# EAGLE design pipower (EAGLE 7.1.0)
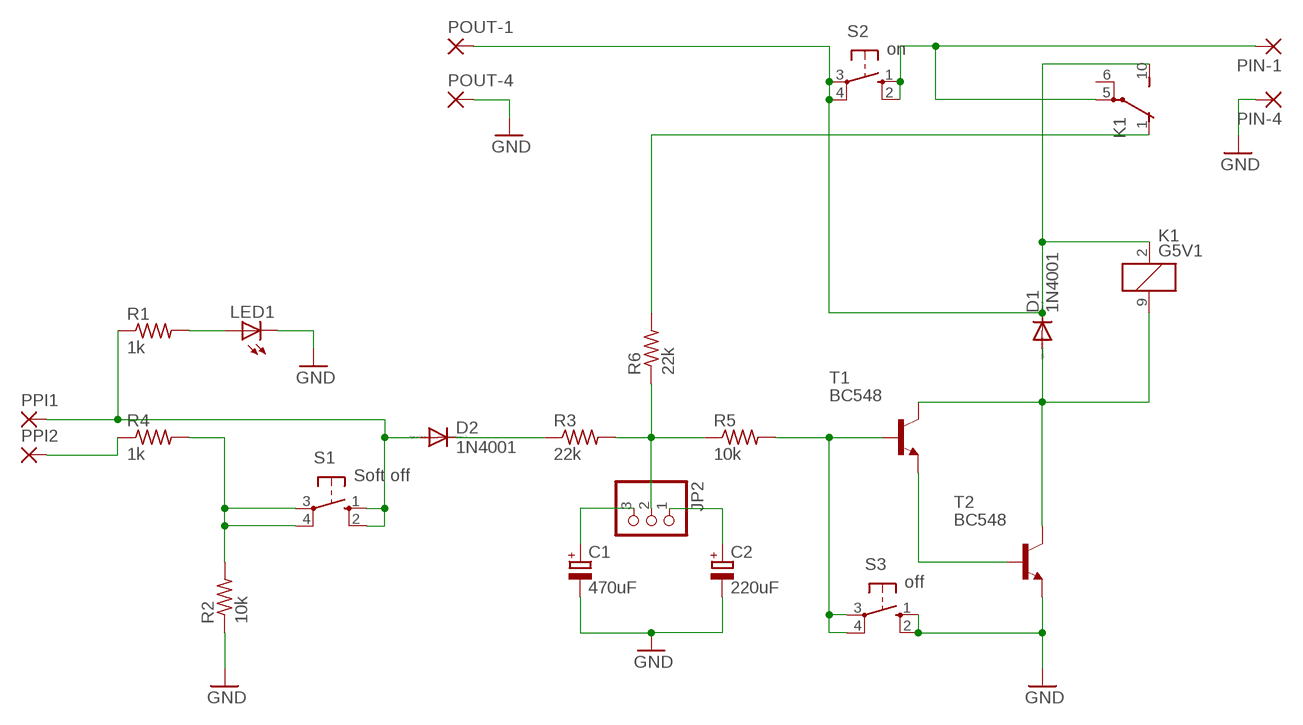
[diagram p0: schematic, sheet 1]

## Parts
C1  470uF  CPOL-EUE2.5-7  [E2,5-7]
C2  220uF  CPOL-EUE2.5-6  [E2,5-6]
D1  1N4001  1N4004  [DO41-10]
D2  1N4001  1N4004  [DO41-10]
JP2  PINHD-1X3  [1X03]
K1  G5V1  [G5V1]
LED1  LED3MM  [LED3MM]
PIN-1  2,54/1,0  [2,54/1,0]
PIN-4  2,54/1,0  [2,54/1,0]
POUT-1  2,54/1,0  [2,54/1,0]
POUT-4  2,54/1,0  [2,54/1,0]
PPI1  2,54/1,0  [2,54/1,0]
PPI2  2,54/1,0  [2,54/1,0]
R1  1k  R-US_0207/7  [0207/7]
R2  10k  R-US_0207/7  [0207/7]
R3  22k  R-US_0207/7  [0207/7]
R4  1k  R-US_0207/7  [0207/7]
R5  10k  R-US_0207/7  [0207/7]
R6  22k  R-US_0207/7  [0207/7]
S1  Soft off  10-XX  [B3F-10XX]
S2  on  10-XX  [B3F-10XX]
S3  off  10-XX  [B3F-10XX]
T1  BC548  BC548-NPN-TO92-CBE  [TO92-CBE]
T2  BC548  BC548-NPN-TO92-CBE  [TO92-CBE]

## Nets
GND: C1.- C2.- LED1.K(C) PIN-4.1(P) POUT-4.1(P) R2.1 S3.1(S) S3.2(S1) T2.E
N$1: PPI2.1(P) R4.1
N$2: R2.2 R4.2 S1.3(P) S1.4(P1)
N$3: D2.C R3.1
N$4: JP2.2 R3.2 R5.1 R6.1
N$5: LED1.A R1.2
N$6: D2.A PPI1.1(P) R1.1 S1.1(S) S1.2(S1)
N$7: R5.2 S3.3(P) S3.4(P1) T1.B
N$8: T1.E T2.B
N$9: D1.A K1.9 T1.C T2.C
N$10: D1.C K1.2 K1.10(2:S) POUT-1.1(P) S2.3(P) S2.4(P1)
N$11: K1.1(2:O) R6.2
N$12: K1.5(2:P) PIN-1.1(P) S2.1(S) S2.2(S1)
N$13: C2.+ JP2.1
N$14: C1.+ JP2.3
Unconnected: K1.6(2:P)

## Library data of the parts
C1 C2 = rcl:CPOL-EU: POLARIZED CAPACITOR, European symbol
D1 D2 = diode:1N4004: DIODE general purpose rectifier, 1 A
JP2 = pinhead:PINHD-1X3: PIN HEADER
K1 = relay:G5V1: RELAY 1 x switch, 0.5 A/125 V AC, 1 A/24 V DC , Omron; MPN: G5V-1-DC24; OC_FARNELL: 9949593; OC_NEWARK: 36M6377
LED1 = led:LED: LED OSRAM: - CHIPLED LG R971, LG N971, LY N971, LG Q971, LY Q971, LO R971, LY R971 LH N974, LH R974 LS Q976, LO Q976, LY Q976 LO Q996 - Hyper CHIPLED LW Q18S LB Q993, LB Q99A, LB R99A - SideLED LS A670, LO A670, LY A670, LG A670, LP A670 LB A673, LV A673, LT A673, LW A673 LH A674 LY A675 LS A676, LA A676, LO A676, LY A676, LW A676 LS A679, LY A679, LG A679 - Hyper Micro SIDELED® LS Y876, LA Y876, LO Y876, LY Y876 LT Y87S - SmartLED LW L88C, LW L88S LB L89C, LB L89S, LG L890 LS L89K, LO L89K, LY L89K LS L896, LA L896, LO L896, LY L896 - TOPLED LS T670, LO T670, LY T670, LG T670, LP T670 LSG T670, LSP T670, LSY T670, LOP T670, LYG T670 LG T671, LOG T671, LSG T671 LB T673, LV T673, LT T673, LW T673 LH T674 LS T676, LA T676, LO T676, LY T676, LB T676, LH T676, LSB T676, LW T676 LB T67C, LV T67C, LT T67C, LS T67K, LO T67K, LY T67K, LW E67C LS E67B, LA E67B, LO E67B, LY E67B, LB E67C, LV E67C, LT E67C LW T67C LS T679, LY T679, LG T679 LS T770, LO T770, LY T770, LG T770, LP T770 LB T773, LV T773, LT T773, LW T773 LH T774 LS E675, LA E675, LY E675, LS T675 LS T776, LA T776, LO T776, LY T776, LB T776 LHGB T686 LT T68C, LB T68C - Hyper Mini TOPLED® LB M676 - Mini TOPLED Santana® LG M470 LS M47K, LO M47K, LY M47K Source: http://www.osram.convergy.de LUXEON: - LUMILED® LXK2-PW12-R00, LXK2-PW12-S00, LXK2-PW14-U00, LXK2-PW14-V00 LXK2-PM12-R00, LXK2-PM12-S00, LXK2-PM14-U00 LXK2-PE12-Q00, LXK2-PE12-R00, LXK2-PE12-S00, LXK2-PE14-T00, LXK2-PE14-U00 LXK2-PB12-K00, LXK2-PB12-L00, LXK2-PB12-M00, LXK2-PB14-N00, LXK2-PB14-P00, LXK2-PB14-Q00 LXK2-PR12-L00, LXK2-PR12-M00, LXK2-PR14-Q00, LXK2-PR14-R00 LXK2-PD12-Q00, LXK2-PD12-R00, LXK2-PD12-S00 LXK2-PH12-R00, LXK2-PH12-S00 LXK2-PL12-P00, LXK2-PL12-Q00, LXK2-PL12-R00 Source: www.luxeon.com KINGBRIGHT: KA-3528ASYC Source: www.kingbright.com
PIN-1 PIN-4 POUT-1 POUT-4 PPI1 PPI2 = wirepad:2,54/1,0: THROUGH-HOLE PAD
R1-R6 = rcl:R-US_: RESISTOR, American symbol
S1-S3 = switch-omron:10-XX: OMRON SWITCH; MPN: B3F-1000; OC_FARNELL: 176432; OC_NEWARK: 36M3542
T1 T2 = transistor:*-NPN-: NPN Transistror BF959 corrected 2008.03.06

## Net classes
0 default: clearance 0.205 mm

## Board
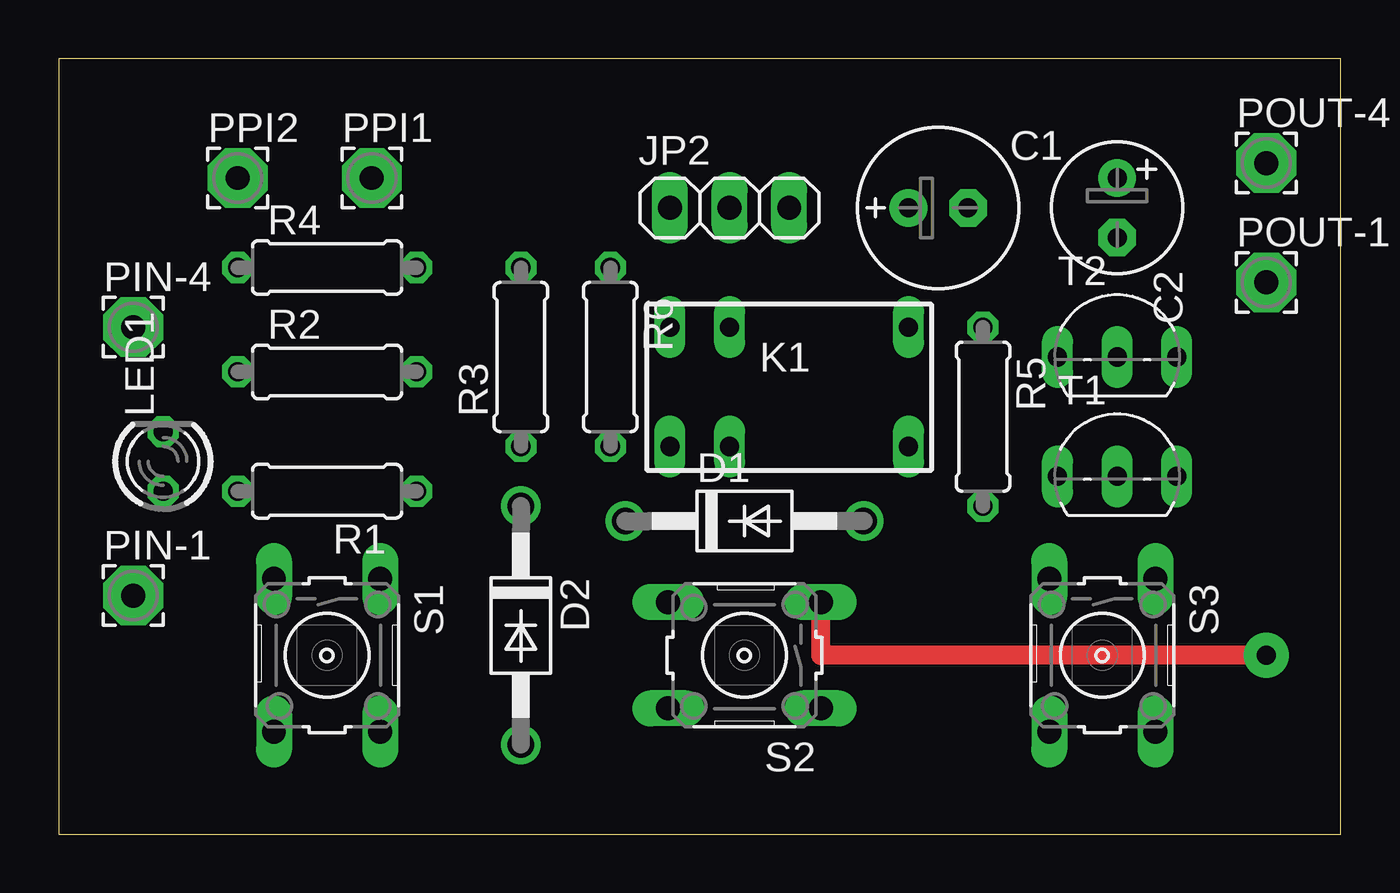
[diagram p1: board, top side]
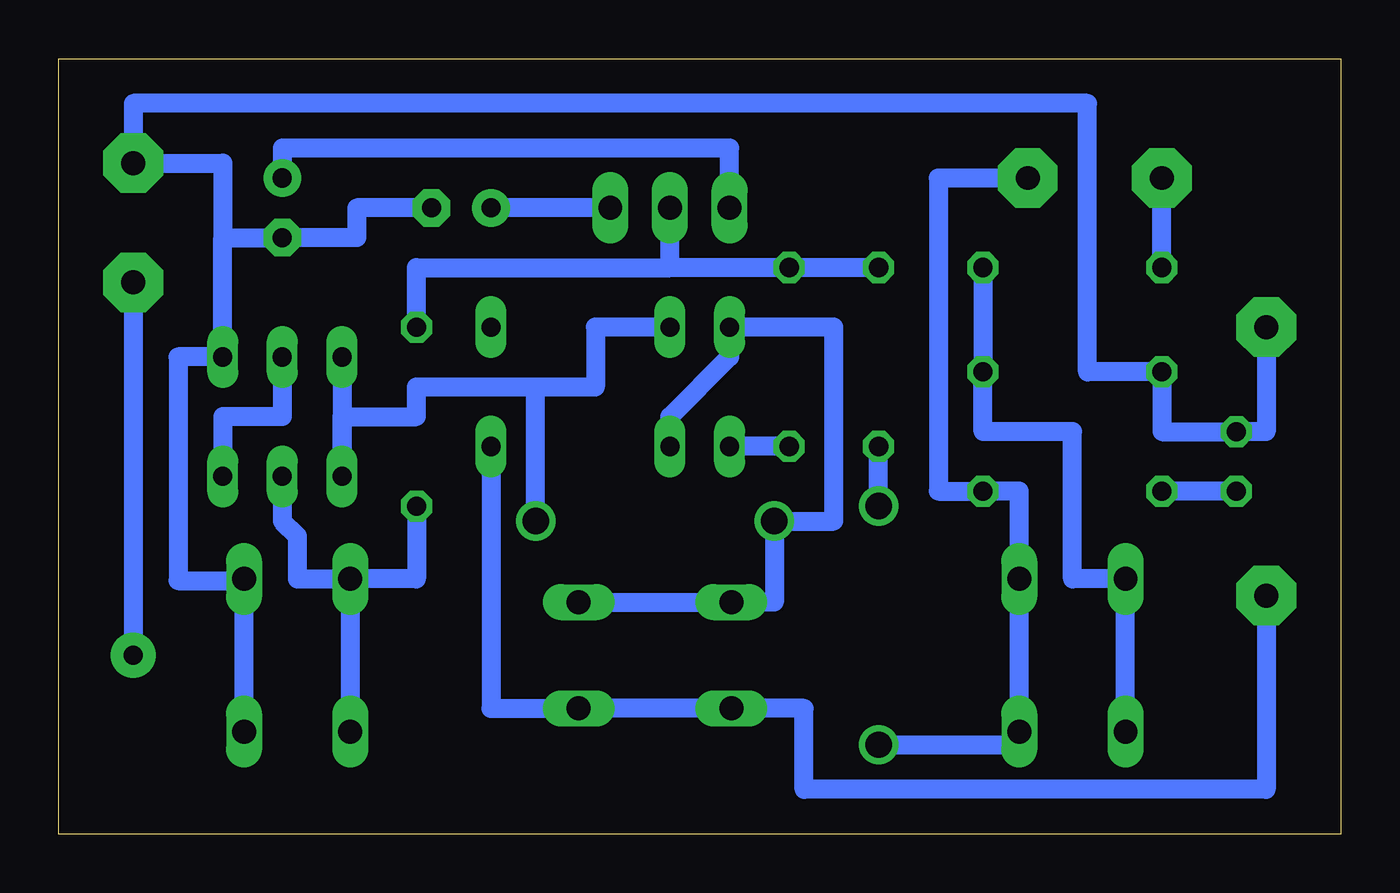
[diagram p2: board, bottom side, seen from below]

Size 54.61 x 33.02 mm. Coordinates in mm from the lower left corner, seen from the top.
Outline: 0,0 54.61,0 54.61,33.02 0,33.02 0,0
Copper layers (1*16): Top 0.035mm / dielectric 1.5mm / Bottom 0.035mm
Design rules "on-off": minimum track width 10mil, minimum drill 24mil, track to track 0.205mm, track to pad 0.205mm, pad to pad 0.205mm, via to via 0.205mm, smd to smd 8mil, copper to edge 40mil, drill to drill 8mil, minimum pad ring 10mil, minimum via ring 8mil, stop-mask expansion 4mil, vias tented up to drill 0mil, thermal gap 10mil

### Footprints (pad centres in the part's own frame; a part is rotated, then mirrored left to right if it is on the bottom)
E2,5-7 = drill 0.813 pad 1.6: + -1.27,0 | drill 0.813 pad 1.6 octagon: - 1.27,0
E2,5-6 = drill 0.813 pad 1.6: + -1.27,0 | drill 0.813 pad 1.6 octagon: - 1.27,0
DO41-10 = drill 1.118: A 5.08,0; C -5.08,0
1X03 = drill 1.016 long: 1 -2.54,0; 2 0,0; 3 2.54,0
G5V1 = drill 0.813 long: 1 -5.08,-2.54; 2 -2.54,-2.54; 5 5.08,-2.54; 6 5.08,2.54; 9 -2.54,2.54; 10 -5.08,2.54
LED3MM = drill 0.813 octagon: A -1.27,0; K 1.27,0
2,54/1,0 = drill 1.016 pad 2.54 octagon: 1 0,0
0207/7 = drill 0.813 octagon: 1 -3.81,0; 2 3.81,0
B3F-10XX = drill 1.016 long: 1 -3.251,2.261; 2 3.251,2.261; 3 -3.251,-2.261; 4 3.251,-2.261
TO92-CBE = drill 0.813 long: B 0,0; C -2.54,0; E 2.54,0

### Placement (x,y rotation side)
C1  37.47,26.67 0 top
C2  45.09,26.67 270 top
D1  29.21,13.34 0 top
D2  19.68,8.89 270 top
JP2  28.57,26.67 0 top
K1  31.11,19.05 0 top
LED1  4.45,15.88 90 top
PIN-1  3.17,10.16 0 top
PIN-4  3.17,21.59 0 top
POUT-1  51.44,23.5 0 top
POUT-4  51.44,28.57 0 top
PPI1  13.34,27.94 0 top
PPI2  7.62,27.94 0 top
R1  11.43,14.61 180 top
R2  11.43,19.68 0 top
R3  19.68,20.32 90 top
R4  11.43,24.13 0 top
R5  39.37,17.78 270 top
R6  23.5,20.32 270 top
S1  11.43,7.62 270 top
S2  29.21,7.62 180 top
S3  44.45,7.62 270 top
T1  45.09,15.24 0 top
T2  45.09,20.32 0 top

### Tracks (layer width: path | path; a pad name or v marks a point on that pad's centre or on a via)
GND
  Bottom 0.813: S3.2 S3.1 46.71,10.79 49.53,10.79 49.53,20.32 T2.E 47.62,25.4 | C1.- 41.91,26.67 41.91,25.4 C2.- 47.62,25.4 | PIN-4.1 3.17,17.14 LED1.K 7.62,17.14 R2.1 10.79,19.68 10.79,31.11 51.44,31.11 POUT-4.1 47.62,28.57 47.62,25.4
N$1
  Bottom 0.813: R4.1 PPI2.1
N$2
  Bottom 0.813: S1.4 S1.3 11.43,10.87 11.43,17.14 15.24,17.14 R2.2 R4.2
N$3
  Bottom 0.813: D2.C R3.1
N$4
  Bottom 0.813: R3.2 R6.1 28.57,24.13 | 28.57,24.13 JP2.2 | R5.1 39.37,24.13 28.57,24.13
N$5
  Bottom 0.813: LED1.A R1.2
N$6
  Bottom 0.813: D2.A 13.69,3.81 S1.2 S1.1 13.69,14.61 R1.1 17.14,14.61 17.14,27.94 PPI1.1
N$7
  Bottom 0.813: S3.3 S3.4 | R5.2 39.37,10.87 S3.3 | T1.B 45.09,13.34 44.45,12.7 44.45,10.87 S3.3
N$8
  Bottom 0.813: T2.B 45.09,17.78 47.62,17.78 T1.E
N$9
  Bottom 0.813: T2.C T1.C 42.55,17.78 39.37,17.78 39.37,19.05 34.29,19.05 | K1.9 31.75,21.59 31.75,19.05 34.29,19.05 | D1.A 34.29,19.05
N$10  (via drill 0.8 pad 1.93)
  Top 0.813: v51.44,7.62 32.46,7.62 S2.3
  Bottom 0.813: S2.3 S2.4 24.13,9.88 D1.C 21.59,13.34 21.59,21.59 K1.10 26.04,20.32 28.57,17.78 K1.2 | POUT-1.1 v51.44,7.62
N$11
  Bottom 0.813: R6.2 K1.1
N$12
  Bottom 0.813: PIN-1.1 3.17,1.91 22.86,1.91 22.86,5.36 S2.2 S2.1 36.2,5.36 K1.5
N$13
  Bottom 0.813: JP2.1 26.04,29.21 45.09,29.21 C2.+
N$14
  Bottom 0.813: JP2.3 C1.+